# Altium project LNA_1.7GHz.PrjPcb
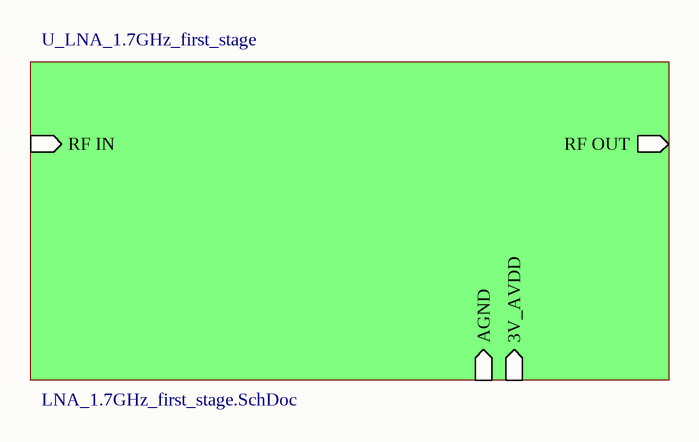
[diagram p0: LNA_1.7GHz_first_stage_symbol.SchDoc]
2 sheets, 19 parts. Net scope: hierarchical (ports join the sheet entries above them; power ports are global).
Board file: LNA_1.7GHz_first_stage.PcbDoc
Sheets:
  LNA_1.7GHz_first_stage_symbol.SchDoc
    U_LNA_1.7GHz_first_stage = LNA_1.7GHz_first_stage.SchDoc

## Sheet LNA_1.7GHz_first_stage_symbol.SchDoc: {Наименование}
size 420 x 297 mm; ApprovedBy: {Утвердил}; CheckedBy: {Проверил}; DrawnBy: {Разраб.}; DocumentNumber: АБВГ 123456.789 00; SheetNumber: 1; SheetTotal: 2; Scale: {Мш.}; PageSetup: Record=PageOptions|CenterHorizontal=False|CenterVertical=False|PrintScale=0.95|XCorrection=0.00|YCorrection=0.00|PrintKind=1|BorderSize=5000000|LeftOffset=0|BottomOffset=0|Orientation=1|PaperLength=1000|PaperWidth=1000|Scale=100|PaperSource=15|PrintQuality=600|MediaType=1|DitherType=10|PaperKind=A4|PrintScaleMode=1; ProcessInspection: {Т.контр.}; Mass: {М.}; NormInspection: {Н.контр.}; Letter1Column: {}; Letter2Column: {}; Letter3Column: {}; DocumentType: {Документ}; Rule: PcbType=ProtelPcb

### Sub-sheets
U_LNA_1.7GHz_first_stage = LNA_1.7GHz_first_stage.SchDoc: RF IN (in), 3V_AVDD (in), AGND (in), RF OUT (out)

### Notes on the sheet
- Перв. примен.
- Справ. №
- Подп. и дата
- Инв. № дубл.
- Взам. инв. №
- Изм.
- Лист
- № докум.
- Подп.
- Дата
- Лит.
- Масса
- Масштаб
- Т.контр.
- Пров.
- Разраб.
- Листов
- Инв. № подл.
- Н.контр.
- Утв.
- Копировал
- Формат А3

## Sheet LNA_1.7GHz_first_stage.SchDoc: {Наименование}
size 420 x 297 mm; ApprovedBy: {Утвердил}; CheckedBy: {Проверил}; DrawnBy: {Разраб.}; DocumentNumber: АБВГ 123456.789 00; SheetNumber: 2; SheetTotal: 2; Scale: {Мш.}; PageSetup: Record=PageOptions|CenterHorizontal=False|CenterVertical=False|PrintScale=0.95|XCorrection=0.00|YCorrection=0.00|PrintKind=1|BorderSize=5000000|LeftOffset=0|BottomOffset=0|Orientation=1|PaperLength=1000|PaperWidth=1000|Scale=100|PaperSource=15|PrintQuality=600|MediaType=1|DitherType=10|PaperKind=A4|PrintScaleMode=1; ProcessInspection: {Т.контр.}; Mass: {М.}; NormInspection: {Н.контр.}; Letter1Column: {}; Letter2Column: {}; Letter3Column: {}; DocumentType: {Документ}; Rule: PcbType=ProtelPcb
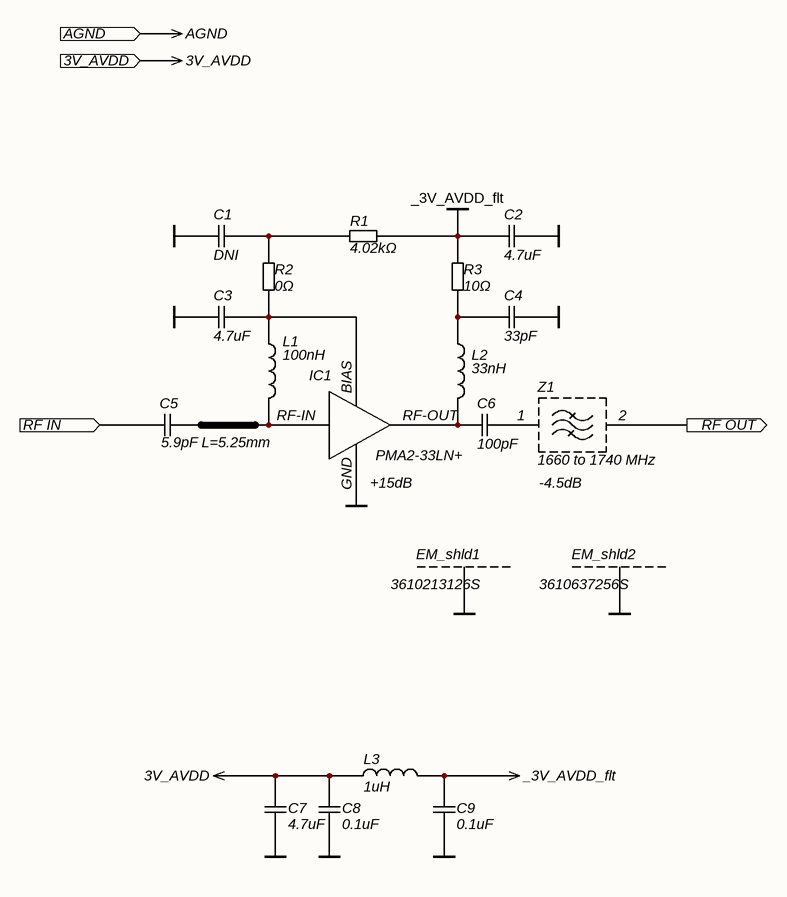
[diagram p1: LNA_1.7GHz_first_stage.SchDoc]

### Parts
C1  DNI  [C0603]
C2  4.7uF  [C0603]
C3  4.7uF  [C0603]
C4  33pF  [C0603]
C5  5.9pF  [C0603]
C6  100pF  [C0603]
C7  4.7uF  [C0603]
C8  0.1uF  [C0603]
C9  0.1uF  [C0603]
EM_shld1  3610213126S  [3610213126S]
EM_shld2  3610637256S  [3610637256S]
IC1  PMA2-33LN+  [MC1631-1_MNC-L]
L1  100nH  [L0603_HP]
L2  33nH  [L0603_HP]
L3  1uH  [L1206_Murata]
R1  4.02kΩ  [R0603]
R2  0Ω  [R0603]
R3  10Ω  [R0603]
Z1  1660 to 1740 MHz  [BPF_1700MHz_10.2_635um]

### Ports
3V_AVDD (in), AGND (in), RF IN (in), RF OUT (out)

### Nets
3V_AVDD: C7.2 C8.2 L3.2 ; port 3V_AVDD
_3V_AVDD_flt: C2.1 C9.2 L3.1 R1.1 R3.2
AGND: C1.1 C2.2 C3.1 C4.2 C7.1 C8.1 C9.1 EM_shld1.1 EM_shld2.1 IC1.GND ; port AGND
NetC1_2: C1.2 R1.2 R2.2
NetC3_2: C3.2 IC1.BIAS L1.1 R2.1
NetC4_1: C4.1 L2.1 R3.1
NetC5_1: C5.1 ; port RF IN
NetC5_2: C5.2 IC1.RF-IN L1.2
NetC6_1: C6.1 IC1.RF-OUT L2.2
NetC6_2: C6.2 Z1.1
NetZ1_2: Z1.2 ; port RF OUT

### Notes on the sheet
- L=5.25mm
- (near IC1) +15dB
- -4.5dB
- Перв. примен.
- Справ. №
- Подп. и дата
- Инв. № дубл.
- Взам. инв. №
- Изм.
- Лист
- № докум.
- Подп.
- Дата
- Лит.
- Масса
- Масштаб
- Т.контр.
- Пров.
- Разраб.
- Листов
- Инв. № подл.
- Н.контр.
- Утв.
- Копировал
- Формат А3

### Library data of the parts
C1-C9 = CAP: Керамический конденсатор; Корпус: 0603 [1608 Метрический]; Диэлектрик: X5R; Напряжение: 16B; Вид монтажа: SMD; Температурный диапазон: -55 ~ 100; Тип элемента: Керамический конденсатор
  C1: Номинал: DNI
  C2 C3 C7: Номинал: 4.7uF
  C4: Номинал: 33pF
  C5: Номинал: 5.9pF
  C6: Номинал: 100pF
  C8 C9: Номинал: 0.1uF
EM_shld1 = RF Shield: RF Shield Frame X 0.522" (13.26mm) Surface Mount; Производитель: Wurth Elektronik; Вид монтажа: SMD/SMT; Тип элемента: EMI/RFI Shield, One-Piece; Примечание: Mate with 3600213120S (Two pieces shield); Артикул: 3610213126S; Корпус: 0.522" (13.26mm)
EM_shld2 = RF Shield: RF Shield Frame X 1.484" (37.70mm) Surface Mount; Производитель: Wurth Elektronik; Вид монтажа: SMD/SMT; Тип элемента: EMI/RFI Shield, One-Piece; Примечание: Mate with 3600637250S (Two pieces shield); Артикул: 3610637256S; Корпус: 1.484" (37.70mm)
IC1 = PMA2-33LN+: Малошумяший усилитель; Производитель: Mini-Circuits; Вид монтажа: SMD; Тип элемента: Микросхема; Температурный диапазон: -40 ~ 100; Название: PMA2-33LN+; Артикул: PMA2-33LN+
L1 L2 = Inducror RF: Индуктивность; Производитель: Coilcraft; Корпус: 0603 [1608 Метрический]; Вид монтажа: SMD; Тип элемента: Катушка индуктивности; Температурный диапазон: -40ºC to 125ºC
  L1: Номинал: 100nH
  L2: Номинал: 33nH
L3 = Inducror LF: Индуктивность; Производитель: Murata; Корпус: 1206 [3216 Metric]; Вид монтажа: SMD; Тип элемента: Катушка индуктивности; Температурный диапазон: -40ºC to 125ºC; Номинал: 1uH
R1-R3 = RES: SMD резистор; Производитель: 1%; Корпус: 0603 [1608 Метрический]; Точность: 1%; Название: Резистор; Вид монтажа: SMD; Тип элемента: Резистор
  R1: Номинал: 4.02kΩ
  R2: Номинал: 0Ω
  R3: Номинал: 10Ω
Z1 = BPF_1700MHz: Полосковый фильтр; Вид монтажа: SMD; Температурный диапазон: -40 ~ 100; Примечание: потери 4.5 дБ; Название: BPF_1700MHz; Артикул: BPF_1700MHz; Номинал: 1660 to 1740 MHz; Тип элемента: Полосковый фильтр